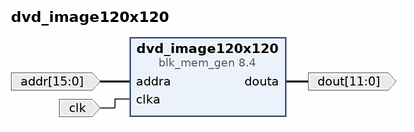
[diagram p0: block diagram of the top level]
# Vivado block design dvd_image120x120, xc7a35tcpg236-1, Vivado 2023.2
create_bd_design dvd_image120x120

create_bd_port -dir I -from 15 -to 0 addr
create_bd_port -dir I -type clk clk
create_bd_port -dir O -from 11 -to 0 dout

create_bd_cell -type ip -vlnv xilinx.com:ip:blk_mem_gen:8.4 dvd_image120x120
set_property -dict [list \
  CONFIG.Coe_File ../../../../../../vga_screen_saver.documents/dvd_ss.COE \
  CONFIG.Enable_A Always_Enabled \
  CONFIG.Load_Init_File true \
  CONFIG.Memory_Type Single_Port_ROM \
  CONFIG.Write_Depth_A 57600 \
  CONFIG.Write_Width_A 12 \
  CONFIG.use_bram_block Stand_Alone \
] [get_bd_cells dvd_image120x120]

# ---- connections ----

connect_bd_net -net addra_0_1 [get_bd_ports addr] [get_bd_pins dvd_image120x120/addra]
connect_bd_net -net clka_0_1 [get_bd_ports clk] [get_bd_pins dvd_image120x120/clka]
connect_bd_net [get_bd_pins dvd_image120x120/douta] [get_bd_ports dout]

validate_bd_design
save_bd_design
